# EAGLE design schematic (EAGLE 9.2.2)
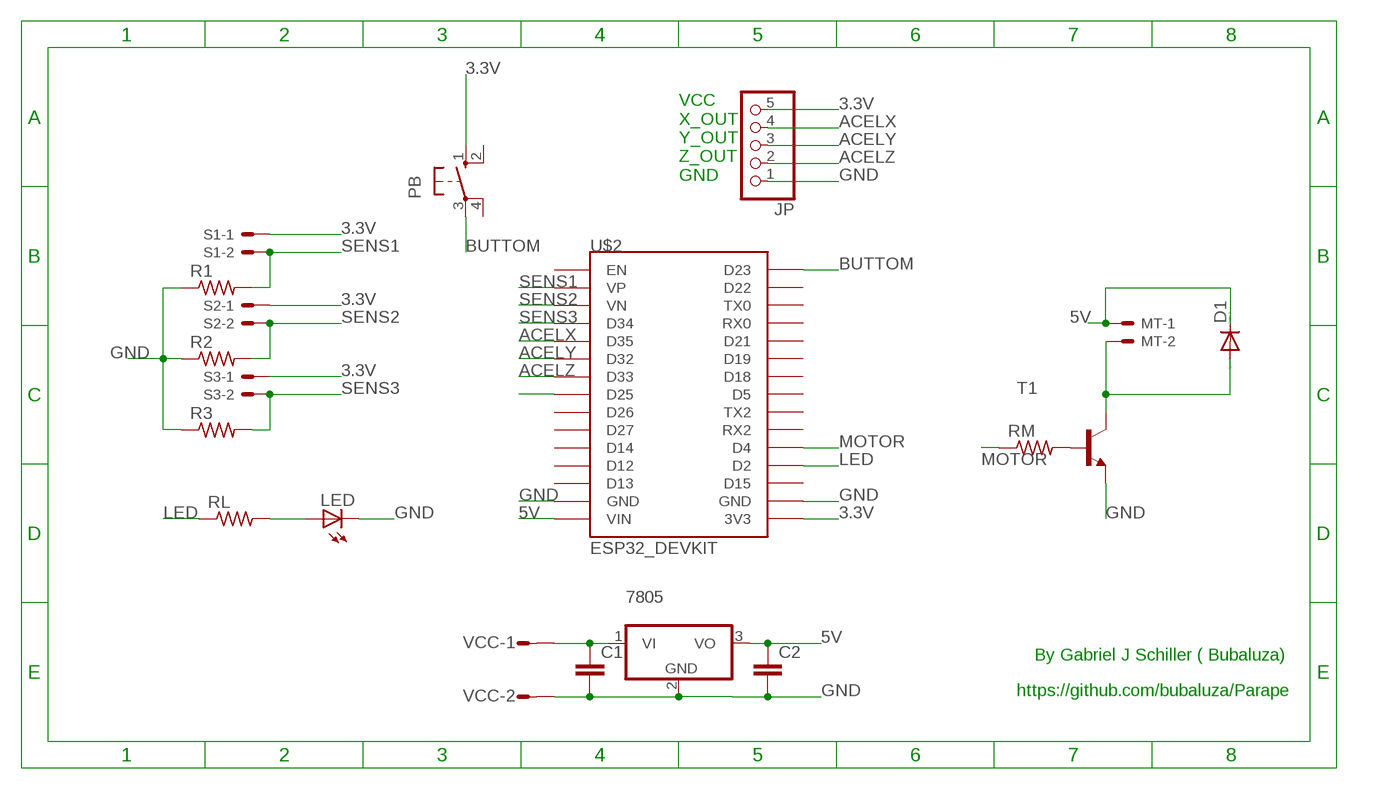
[diagram p0: schematic, sheet 1]

## Parts
7805  786TV  [TO220V]
C1  C2,5-3  [C2.5-3]
C2  C2,5-3  [C2.5-3]
D1  1N4148DO35-10  [DO35-10]
JP  PINHD-1X5  [1X05]
LED  LED5MM  [LED5MM]
MT  332-02  [332-02]
PB  10-XX  [B3F-10XX]
R1  R-US_0207/7  [0207/7]
R2  R-US_0207/7  [0207/7]
R3  R-US_0207/7  [0207/7]
RL  R-US_0207/7  [0207/7]
RM  R-US_0207/7  [0207/7]
S1  332-02  [332-02]
S2  332-02  [332-02]
S3  332-02  [332-02]
T1  2N2222  [TO18]
U$2  ESP32_DEVKIT  [ESP32_DEVKIT]
VCC  L02P  [L02P]

## Nets
3.3V: JP.5 PB.1(S) S1.1 S2.1 S3.1 U$2.3V3
5V: 7805.3(VO) C2.1 D1.C MT.1 U$2.VIN
ACELX: JP.4 U$2.D35
ACELY: JP.3 U$2.D32
ACELZ: JP.2 U$2.D33
BUTTOM: PB.3(P) U$2.D23
GND: 7805.2(GND) C1.2 C2.2 JP.1 LED.K(C) R1.1 R2.1 R3.1 T1.1(E) U$2.GND@1(GND) U$2.GND@2(GND) VCC.2
LED: RL.1 U$2.D2
MOTOR: RM.1 U$2.D4
N$1: 7805.1(VI) C1.1 VCC.1
N$8: U$2.D25
N$9: RM.2 T1.2(B)
N$10: D1.A MT.2 T1.3(C)
N$12: LED.A RL.2
SENS1: R1.2 S1.2 U$2.VP
SENS2: R2.2 S2.2 U$2.VN
SENS3: R3.2 S3.2 U$2.D34
Unconnected: PB.2(S1) PB.4(P1) U$2.D5 U$2.D12 U$2.D13 U$2.D14 U$2.D15 U$2.D18 U$2.D19 U$2.D21 U$2.D22 U$2.D26 U$2.D27 U$2.EN U$2.RX0 U$2.RX2 U$2.TX0 U$2.TX2

## Notes on the sheet
- VCC
  X_OUT
  Y_OUT
  Z_OUT
  GND
- By Gabriel J Schiller ( Bubaluza)
- https://github.com/bubaluza/Parape

## Library data of the parts
7805 = linear:78*: Positive VOLTAGE REGULATOR Source: http://cache.national.com/ds/LM/LM78L05.pdf http://www.fairchildsemi.com/ds/LM/LM7805.pdf
C1 C2 = capacitor-wima:C: CAPACITOR naming: grid - package width
D1 = diode:1N4148: DIODE high speed (Philips)
JP = pinhead:PINHD-1X5: PIN HEADER
LED = led:LED: LED OSRAM: - CHIPLED LG R971, LG N971, LY N971, LG Q971, LY Q971, LO R971, LY R971 LH N974, LH R974 LS Q976, LO Q976, LY Q976 LO Q996 - Hyper CHIPLED LW Q18S LB Q993, LB Q99A, LB R99A - SideLED LS A670, LO A670, LY A670, LG A670, LP A670 LB A673, LV A673, LT A673, LW A673 LH A674 LY A675 LS A676, LA A676, LO A676, LY A676, LW A676 LS A679, LY A679, LG A679 - Hyper Micro SIDELED® LS Y876, LA Y876, LO Y876, LY Y876 LT Y87S - SmartLED LW L88C, LW L88S LB L89C, LB L89S, LG L890 LS L89K, LO L89K, LY L89K LS L896, LA L896, LO L896, LY L896 - TOPLED LS T670, LO T670, LY T670, LG T670, LP T670 LSG T670, LSP T670, LSY T670, LOP T670, LYG T670 LG T671, LOG T671, LSG T671 LB T673, LV T673, LT T673, LW T673 LH T674 LS T676, LA T676, LO T676, LY T676, LB T676, LH T676, LSB T676, LW T676 LB T67C, LV T67C, LT T67C, LS T67K, LO T67K, LY T67K, LW E67C LS E67B, LA E67B, LO E67B, LY E67B, LB E67C, LV E67C, LT E67C LW T67C LS T679, LY T679, LG T679 LS T770, LO T770, LY T770, LG T770, LP T770 LB T773, LV T773, LT T773, LW T773 LH T774 LS E675, LA E675, LY E675, LS T675 LS T776, LA T776, LO T776, LY T776, LB T776 LHGB T686 LT T68C, LB T68C - Hyper Mini TOPLED® LB M676 - Mini TOPLED Santana® LG M470 LS M47K, LO M47K, LY M47K Source: http://www.osram.convergy.de LUXEON: - LUMILED® LXK2-PW12-R00, LXK2-PW12-S00, LXK2-PW14-U00, LXK2-PW14-V00 LXK2-PM12-R00, LXK2-PM12-S00, LXK2-PM14-U00 LXK2-PE12-Q00, LXK2-PE12-R00, LXK2-PE12-S00, LXK2-PE14-T00, LXK2-PE14-U00 LXK2-PB12-K00, LXK2-PB12-L00, LXK2-PB12-M00, LXK2-PB14-N00, LXK2-PB14-P00, LXK2-PB14-Q00 LXK2-PR12-L00, LXK2-PR12-M00, LXK2-PR14-Q00, LXK2-PR14-R00 LXK2-PD12-Q00, LXK2-PD12-R00, LXK2-PD12-S00 LXK2-PH12-R00, LXK2-PH12-S00 LXK2-PL12-P00, LXK2-PL12-Q00, LXK2-PL12-R00 Source: www.luxeon.com KINGBRIGHT: KA-3528ASYC Source: www.kingbright.com
MT S1-S3 = con-garry:332-02: 2 Pin - 2mm Dual Row Source: www.mpe-connector.de / garry_shortform_2012.pdf
PB = switch-omron:10-XX: OMRON SWITCH; MPN: B3F-1000; OC_FARNELL: 176432; OC_NEWARK: 36M3542
R1-R3 RL RM = rcl:R-US_: RESISTOR, American symbol; SPICEPREFIX: R
T1 = transistor-neu-to92:2N2222: NPN TRANSISTOR
U$2 = DOIT_ESP32_DEVKIT:ESP32_DEVKIT: ESP32 DEVKIT BOARD
VCC = con-amp-mt:L02P: AMP MT CONNECTOR; OC_FARNELL: unknown; OC_NEWARK: unknown

## Board
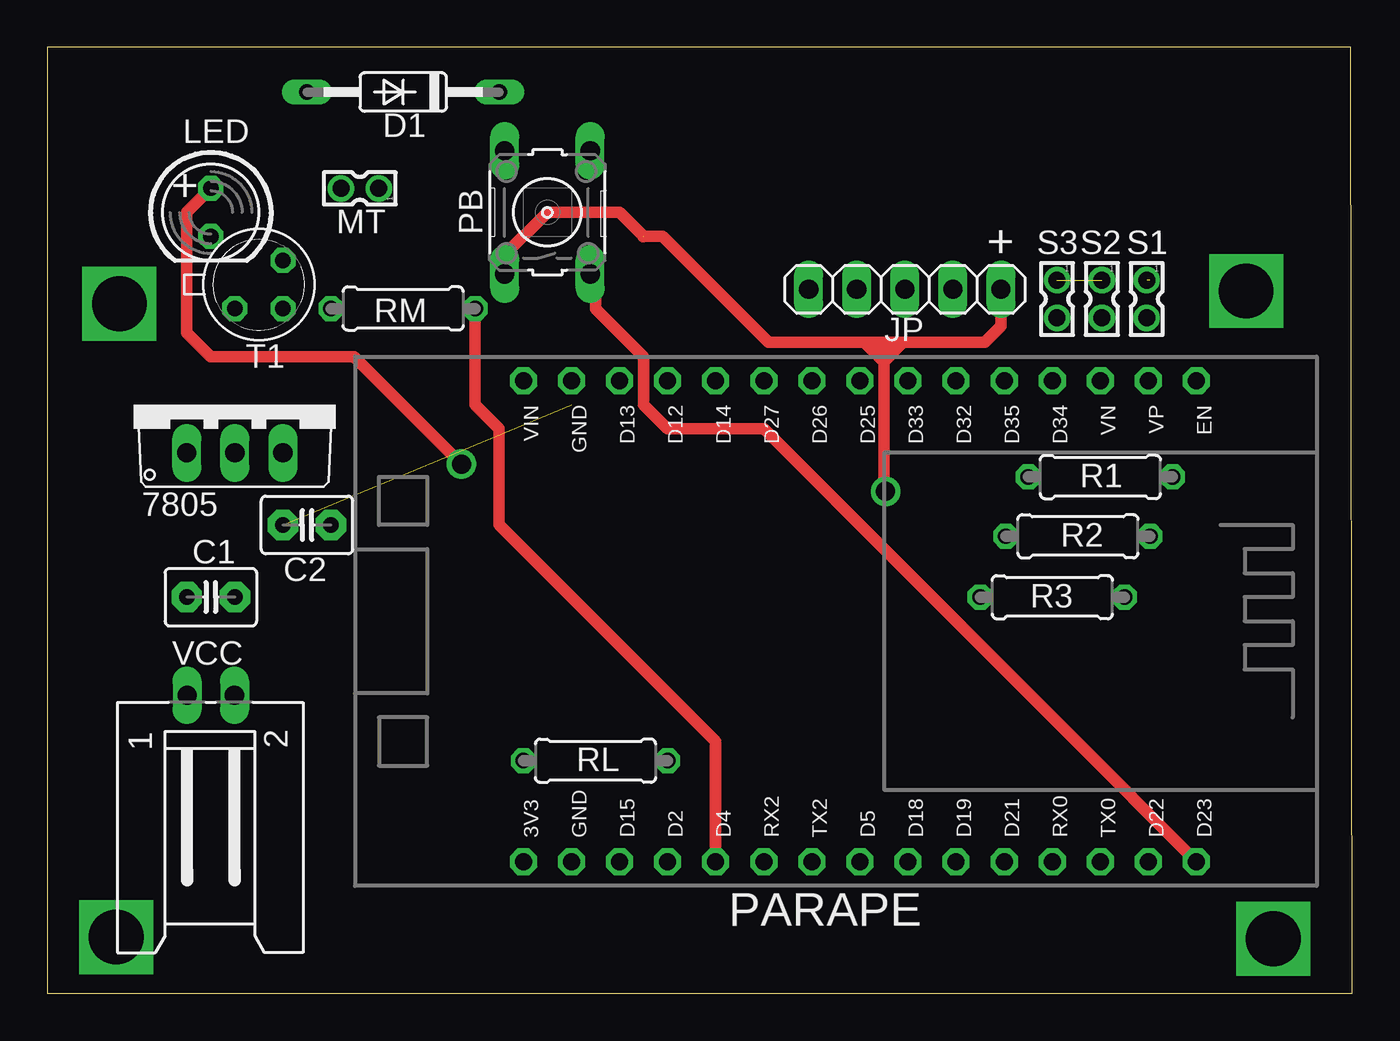
[diagram p1: board, top side]
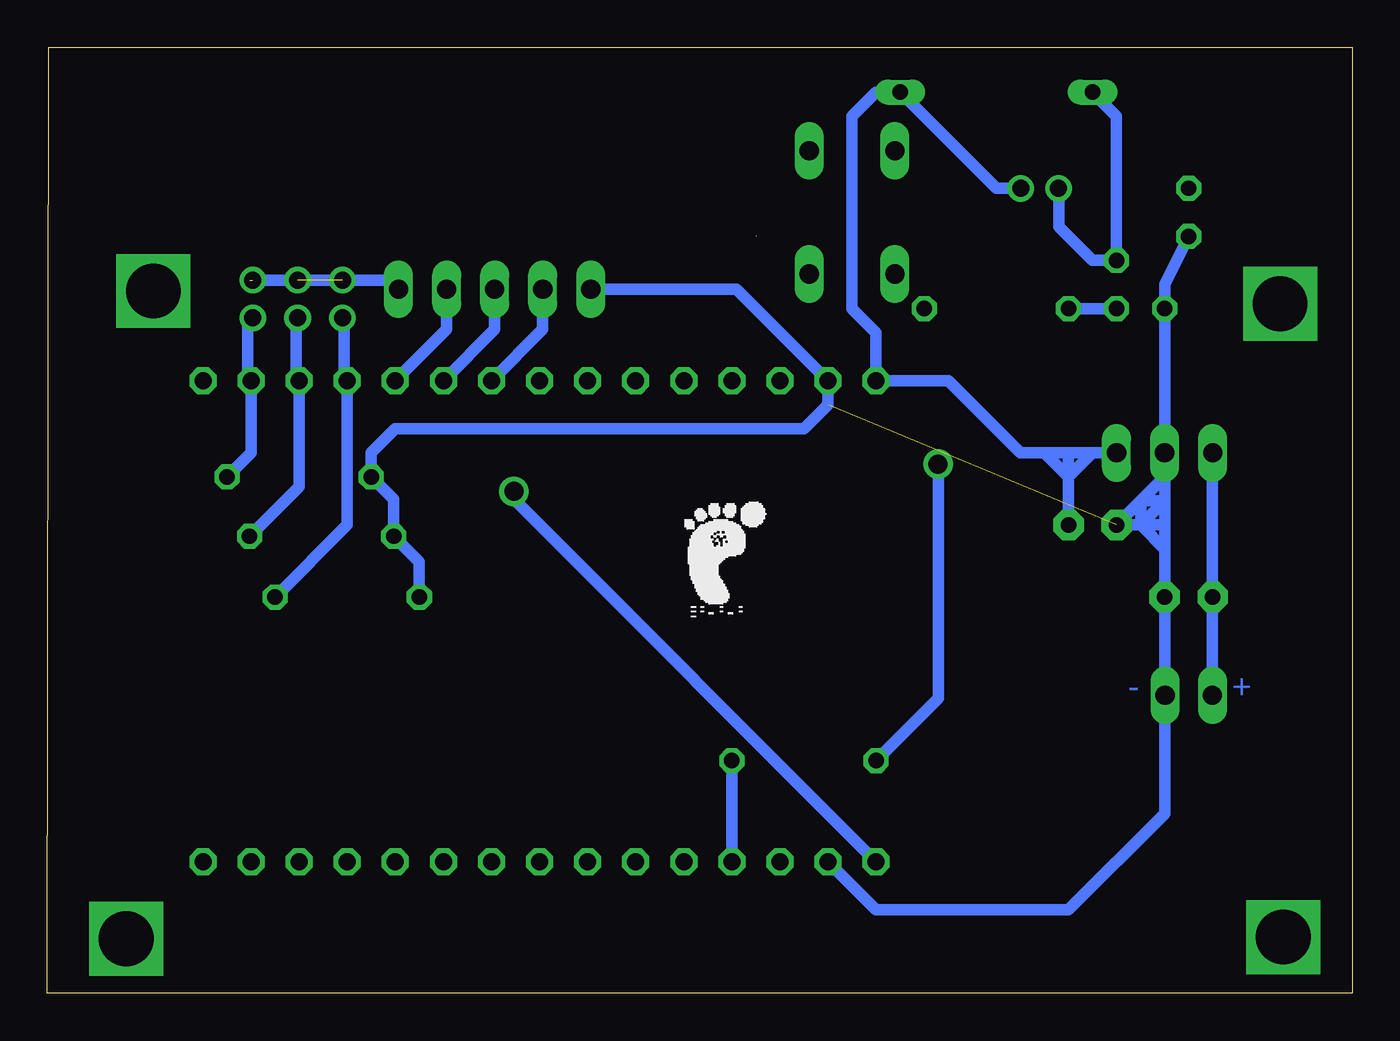
[diagram p2: board, bottom side, seen from below]

Size 68.93 x 49.95 mm. Coordinates in mm from the lower left corner, seen from the top.
Outline: 0,0 68.93,0 68.84,49.95 0,49.95 0,0
Copper layers (1*16): Top 0.035mm / dielectric 1.5mm / Bottom 0.035mm
Design rules "default": minimum track width 6mil, minimum drill 0.35mm, track to track 6mil, track to pad 6mil, pad to pad 6mil, via to via 6mil, smd to smd 6mil, copper to edge 40mil, drill to drill 6mil, minimum pad ring 10mil, minimum via ring 8mil, stop-mask expansion 4mil, vias tented up to drill 0mil, thermal gap 10mil

### Footprints (pad centres in the part's own frame; a part is rotated, then mirrored left to right if it is on the bottom)
TO220V = drill 1.016 long: 1 -2.54,-2.54; 2 0,-2.54; 3 2.54,-2.54
C2.5-3 = drill 0.813 pad 1.6 octagon: 1 -1.27,0; 2 1.27,0
DO35-10 = drill 0.813 long: A 5.08,0; C -5.08,0
1X05 = drill 1.016 long: 1 -5.08,0; 2 -2.54,0; 3 0,0; 4 2.54,0; 5 5.08,0
LED5MM = drill 0.813 octagon: A -1.27,0; K 1.27,0
332-02 = drill 0.9 pad 1.27: 1 0,-1; 2 0,1
B3F-10XX = drill 1.016 long: 1 -3.251,2.261; 2 3.251,2.261; 3 -3.251,-2.261; 4 3.251,-2.261
0207/7 = drill 0.813 octagon: 1 -3.81,0; 2 3.81,0
TO18 = drill 0.813 octagon: 1 -1.27,-1.27; 2 1.27,-1.27; 3 1.27,1.27
ESP32_DEVKIT = drill 0.9 pad 1.422 octagon: 3V3 11.43,-17.78; D2 11.43,-10.16; D4 11.43,-7.62; D5 11.43,0; D12 -13.97,-10.16; D13 -13.97,-12.7; D14 -13.97,-7.62; D15 11.43,-12.7; D18 11.43,2.54; D19 11.43,5.08; D21 11.43,7.62; D22 11.43,15.24; D23 11.43,17.78; D25 -13.97,0; D26 -13.97,-2.54; D27 -13.97,-5.08; D32 -13.97,5.08; D33 -13.97,2.54; D34 -13.97,10.16; D35 -13.97,7.62; EN -13.97,17.78; GND@1 -13.97,-15.24; GND@2 11.43,-15.24; RX0 11.43,10.16; RX2 11.43,-5.08; TX0 11.43,12.7; TX2 11.43,-2.54; VIN -13.97,-17.78; VN -13.97,12.7; VP -13.97,15.24
L02P = drill 1.016 long: 1 1.25,-6.25; 2 -1.25,-6.25

### Placement (x,y rotation side)
7805  9.91,31.07 0 top
C1  8.64,20.91 0 top
C2  13.72,24.72 180 top
D1  18.8,47.58 180 top
JP  45.3,37.17 0 top
LED  8.64,41.23 270 top
MT  16.51,42.5 90 top
PB  26.42,41.23 90 top
R1  55.63,27.26 0 top
R2  54.44,24.13 0 top
R3  53.09,20.91 0 top
RL  28.96,12.28 180 top
RM  18.8,36.15 180 top
S1  58.08,36.66 180 top
S2  55.7,36.66 180 top
S3  53.33,36.66 180 top
T1  11.18,37.42 0 top
U$2  42.93,18.37 270 top
VCC  8.64,9.48 180 top

### Tracks (layer width: path | path; a pad name or v marks a point on that pad's centre or on a via)
3.3V  (via drill 1 pad 1.55)  (3 unrouted)
  Top 0.61: PB.1 23.88,38.69 26.42,41.23 30.23,41.23 31.5,39.96 32.5,39.96 38.1,34.37 43.18,34.37 | 31.48,39.98 31.48,39.94 | 43.18,34.37 44.19,34.37 | 44.19,34.37 45.21,34.37 | 45.21,34.37 49.53,34.37 50.38,35.22 JP.5 | 44.19,33.36 43.18,34.37 | 44.19,33.36 45.21,34.37 | 45.21,34.37 | 44.19,33.36 44.19,34.37 | 44.19,33.36 44.19,26.58 v44.28,26.5
  Bottom 0.61: S1.1 S2.1 | 58.24,37.66 50.86,37.66 JP.5 | v44.28,26.5 44.28,26.07 U$2.3V3
5V
  Bottom 0.61: 7805.3 13.72,28.53 | 13.72,28.53 14.99,28.53 | 14.99,28.53 16.26,28.53 | 16.26,28.53 17.53,28.53 21.34,32.34 U$2.VIN 25.15,34.88 26.42,36.15 26.42,46.31 25.15,47.58 D1.C 18.79,42.5 MT.1 | C2.1 14.99,27.26 | 14.99,27.26 14.99,28.53 | 14.99,27.26 16.26,28.53 | 14.99,27.26 13.72,28.53
ACELX
  Bottom 0.61: JP.4 47.84,35.05 U$2.D35
ACELY
  Bottom 0.61: JP.3 45.3,35.05 U$2.D32
ACELZ
  Bottom 0.61: JP.2 42.76,35.05 U$2.D33
BUTTOM
  Top 0.61: U$2.D23 53.93,13.72 37.85,29.8 32.77,29.8 31.5,31.07 31.5,33.61 28.96,36.15 28.96,37.7 PB.3
GND  (1 unrouted)
  Bottom 0.61: 9.91,23.45 C1.2 9.91,15.75 VCC.2 9.91,15.71 9.91,9.48 14.99,4.4 25.15,4.4 U$2.GND@2 | 9.91,23.45 9.91,24.72 | 9.91,24.72 9.91,25.99 | 9.91,25.99 7805.2 | C2.2 11.18,25.99 | 11.18,25.99 9.91,27.26 7805.2 | C2.2 9.91,24.72 | C2.2 11.18,24.72 | 11.18,24.72 9.91,25.99 | 11.18,24.72 11.18,25.99 | 9.91,25.99 11.18,25.99 | 11.18,24.72 9.91,23.45 | 7805.2 9.91,32.34 T1.1 9.91,37.42 LED.K | R3.1 49.28,22.78 R2.1 50.63,26.08 R1.1 51.82,28.53 50.55,29.8 45.72,29.8 28.96,29.8 27.69,31.07 U$2.GND@1 32.51,37.17 JP.1
LED
  Bottom 0.61: U$2.D2 RL.1
MOTOR
  Top 0.61: U$2.D4 35.31,13.29 23.88,24.72 23.88,26.41 23.88,29.8 22.61,31.07 RM.1
N$1
  Bottom 0.61: VCC.1 7.39,20.91 | 7.39,20.91 7.39,28.51 7805.1 | C1.1 7.39,20.91
N$2  (via drill 2.89 pad 3.84)
  other vias: 63.32,37.08
N$3  (via drill 2.89 pad 3.84)
  other vias: 3.81,36.4
N$4  (via drill 2.89 pad 3.84)
  other vias: 64.76,2.88
N$5  (via drill 2.89 pad 3.84)
  other vias: 3.64,2.96
N$9
  Bottom 0.61: RM.2 T1.2
N$10
  Bottom 0.61: D1.A 12.45,46.31 12.45,41.31 12.45,38.77 T1.3 13.72,38.69 15.49,40.47 15.49,42.48 MT.2
N$12  (via drill 1 pad 1.55)
  Top 0.61: LED.A 7.37,41.23 7.37,34.88 8.64,33.61 16.2,33.61 v21.88,27.94
  Bottom 0.61: RL.2 21.84,15.58 21.84,26.75 | 21.84,26.75 21.84,27.35 | v21.88,27.94 21.84,27.9 21.84,26.75
SENS1
  Bottom 0.61: R1.2 58.17,28.53 58.17,29.8 U$2.VP 58.34,32.51 58.34,35.4 S1.2
SENS2
  Bottom 0.61: R2.2 55.63,26.76 U$2.VN 55.8,32.51 55.8,35.75 S2.2
SENS3
  Bottom 0.61: R3.2 53.09,24.72 U$2.D34 53.26,32.51 53.26,35.58 S3.2

### Text on the board
Bottom: + | -
tNames: + | + | PARAPE